# Altium schematic sheet infra_red.SchDoc
size A4; Engineer: Amir Hossein Jobeiri; Organization: Simaran; SheetNumber: 20; SheetTotal: 24
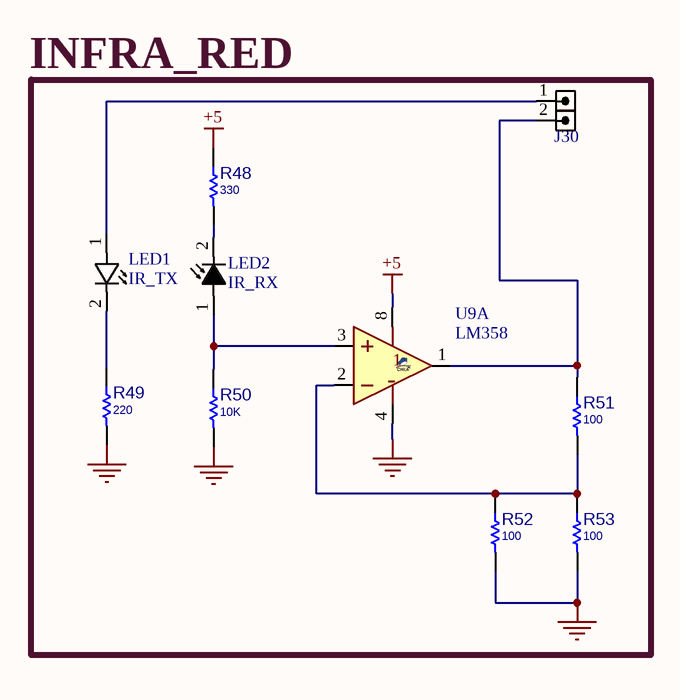
[diagram p0: infra_red.SchDoc]

## Parts
J30  HDRM2  [HDR_M_1X2]  (value not drawn)
LED1  IR_TX  [LED5MM_RED]
LED2  IR_RX  [LED5MM_RED]
R48  330  [R025W_AX04]
R49  220  [R025W_AX04]
R50  10K  [R025W_AX04]
R51  100  [R025W_AX04]
R52  100  [R025W_AX04]
R53  100  [R025W_AX04]
U9  LM358  [DIP_8]  (part A of 2)

## Blocks framed on the sheet
INFRA_RED: J30 LED1 LED2 R48-R53 U9

## Nets
+5: R48.1 U9.8(V+)
GND: R49.2 R50.2 R52.2 R53.2 U9.4(V-)
NetJ30_1: J30.1 LED1.1(ANODE)
NetJ30_2: J30.2 R51.1 U9.1(OUT)
NetLED1_2: LED1.2(CATHODE) R49.1
NetLED2_1: LED2.1(ANODE) R50.1 U9.3(IN+)
NetLED2_2: LED2.2(CATHODE) R48.2
NetR51_2: R51.2 R52.1 R53.1 U9.2(IN-)

## Library data of the parts
J30 = HDR_M_1X2: CONN, HEADER, Male, pitch: 2.54mm, 2POS; VALUE: HDRM2
LED1 = IR_TX: CREATED BY J; VALUE: IR_TX; PARAM: *; PARAM1: *; MANF: *; MANF_P#: *
LED2 = IR_RX: CREATED BY J; VALUE: IR_RX; PARAM: *; PARAM1: *; MANF: *; MANF_P#: *
R48-R53 = RES_THD: RESISTOR, THD; MANF_P#: RK73H1ETTP4701F; MANF: KOA SPEER; PARAM: 0.063W; DESC: DESCRIPTION; DIST#: MOUSER; PARAM2: 1%; ASSEMBLY: ASSEMBLY; PRICE: 100= 0.5$
  R48: VALUE: 330
  R49: VALUE: 220
  R50: VALUE: 10K
  R51-R53: VALUE: 100
U9 = LM358_DIP8: AMP, Dual, Low-Power; MANF: Texas Instruments, Fairchild; MANF_P#: LM358AN; PARAM2: 3 V ~ 32 V, ±1.5 V ~ 16 V; PRICE: -; VALUE: LM358